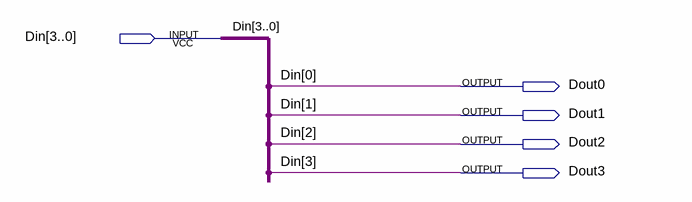
[diagram p0: schematic sheet]
// Quartus schematic cvt_4x1_1x4.bdf as structural Verilog: 0 symbols, 5 pins
module cvt_4x1_1x4 (
  input  [3:0] Din,
  output Dout0,
  output Dout1,
  output Dout2,
  output Dout3
);


  assign Dout0 = Din[0];
  assign Dout1 = Din[1];
  assign Dout2 = Din[2];
  assign Dout3 = Din[3];
endmodule
